# Altium schematic sheet Connectors.SchDoc
size A4
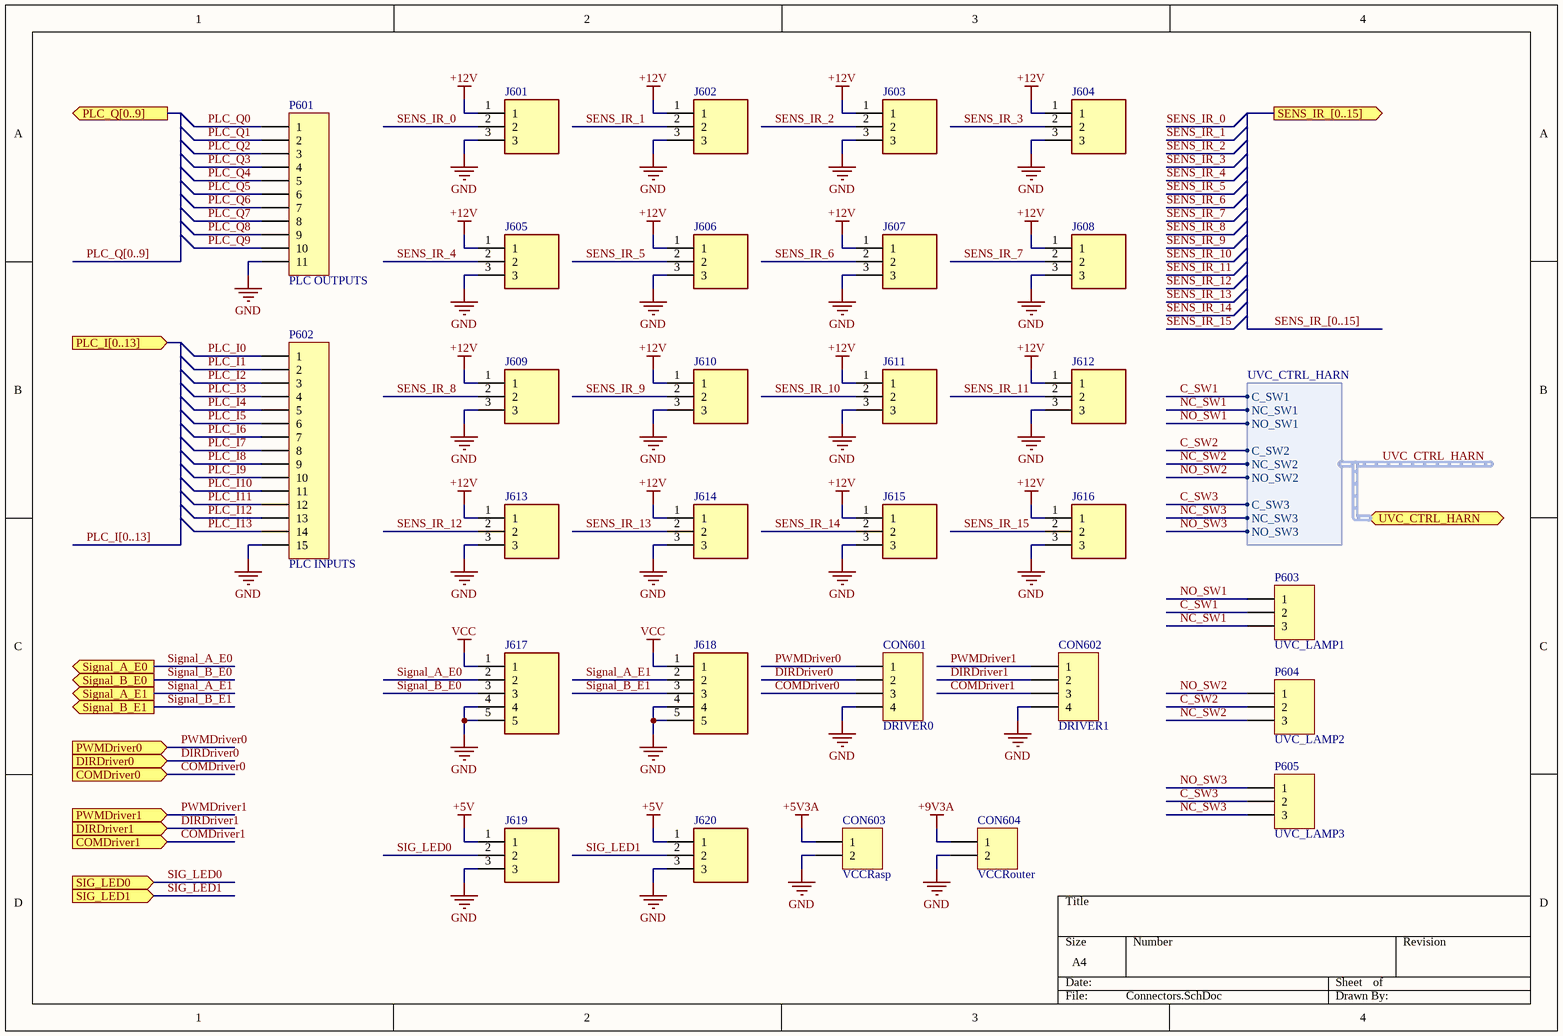
[diagram p0: Connectors.SchDoc]

## Parts
CON601  VALOR: DRIVER0  [PW4 - Recto]  (hidden comment: Header PW4 - Recto)
CON602  VALOR: DRIVER1  [PW4 - Recto]  (hidden comment: Header PW4 - Recto)
CON603  VALOR: VCCRasp  [PW2 - Recto]  (hidden comment: Header PW2 - Recto)
CON604  VALOR: VCCRouter  [PW2 - Recto]  (hidden comment: Header PW2 - Recto)
J601  TBL002A-350-03GR-2OR  [CUI_TBL002A-350-03GR-2OR]  (value not drawn)
J602  TBL002A-350-03GR-2OR  [CUI_TBL002A-350-03GR-2OR]  (value not drawn)
J603  TBL002A-350-03GR-2OR  [CUI_TBL002A-350-03GR-2OR]  (value not drawn)
J604  TBL002A-350-03GR-2OR  [CUI_TBL002A-350-03GR-2OR]  (value not drawn)
J605  TBL002A-350-03GR-2OR  [CUI_TBL002A-350-03GR-2OR]  (value not drawn)
J606  TBL002A-350-03GR-2OR  [CUI_TBL002A-350-03GR-2OR]  (value not drawn)
J607  TBL002A-350-03GR-2OR  [CUI_TBL002A-350-03GR-2OR]  (value not drawn)
J608  TBL002A-350-03GR-2OR  [CUI_TBL002A-350-03GR-2OR]  (value not drawn)
J609  TBL002A-350-03GR-2OR  [CUI_TBL002A-350-03GR-2OR]  (value not drawn)
J610  TBL002A-350-03GR-2OR  [CUI_TBL002A-350-03GR-2OR]  (value not drawn)
J611  TBL002A-350-03GR-2OR  [CUI_TBL002A-350-03GR-2OR]  (value not drawn)
J612  TBL002A-350-03GR-2OR  [CUI_TBL002A-350-03GR-2OR]  (value not drawn)
J613  TBL002A-350-03GR-2OR  [CUI_TBL002A-350-03GR-2OR]  (value not drawn)
J614  TBL002A-350-03GR-2OR  [CUI_TBL002A-350-03GR-2OR]  (value not drawn)
J615  TBL002A-350-03GR-2OR  [CUI_TBL002A-350-03GR-2OR]  (value not drawn)
J616  TBL002A-350-03GR-2OR  [CUI_TBL002A-350-03GR-2OR]  (value not drawn)
J617  TBL002A-350-05GR-2OR  [CUI_TBL002A-350-05GR-2OR]  (value not drawn)
J618  TBL002A-350-05GR-2OR  [CUI_TBL002A-350-05GR-2OR]  (value not drawn)
J619  TBL002A-350-03GR-2OR  [CUI_TBL002A-350-03GR-2OR]  (value not drawn)
J620  TBL002A-350-03GR-2OR  [CUI_TBL002A-350-03GR-2OR]  (value not drawn)
P601  PLC OUTPUTS  [SPTAF_1/15-3.5-EL_11POS]
P602  PLC INPUTS  [SPTAF_1/15-3.5-EL_15POS]
P603  UVC_LAMP1  [Terminal_3way_508]
P604  UVC_LAMP2  [Terminal_3way_508]
P605  UVC_LAMP3  [Terminal_3way_508]

## Ports
COMDriver0 (in), COMDriver1 (in), DIRDriver0 (in), DIRDriver1 (in), PLC_I[0..13] (in), PLC_Q[0..9] (out), PWMDriver0 (in), PWMDriver1 (in), SENS_IR_[0..15] (out), SIG_LED0 (in), SIG_LED1 (in), Signal_A_E0 (out), Signal_A_E1 (out), Signal_B_E0 (out), Signal_B_E1 (out), UVC_CTRL_HARN (harness UVC_CTRL_HARN)

## Harnesses
UVC_CTRL_HARN: C_SW1, NC_SW1, NO_SW1, C_SW2, NC_SW2, NO_SW2, C_SW3, NC_SW3, NO_SW3

## Nets
+5V: J619.1 J620.1
+5V3A: CON603.1
+9V3A: CON604.1
+12V: J601.1 J602.1 J603.1 J604.1 J605.1 J606.1 J607.1 J608.1 J609.1 J610.1 J611.1 J612.1 J613.1 J614.1 J615.1 J616.1
GND: CON601.4 CON602.4 CON603.2 CON604.2 J601.3 J602.3 J603.3 J604.3 J605.3 J606.3 J607.3 J608.3 J609.3 J610.3 J611.3 J612.3 J613.3 J614.3 J615.3 J616.3 J617.4 J617.5 J618.4 J618.5 J619.3 J620.3 P601.11 P602.15
VCC: J617.1 J618.1
C_SW1: P603.2 ; port UVC_CTRL_HARN.C_SW1
C_SW2: P604.2 ; port UVC_CTRL_HARN.C_SW2
C_SW3: P605.2 ; port UVC_CTRL_HARN.C_SW3
COMDriver0: CON601.3 ; port COMDriver0
COMDriver1: CON602.3 ; port COMDriver1
DIRDriver0: CON601.2 ; port DIRDriver0
DIRDriver1: CON602.2 ; port DIRDriver1
NC_SW1: P603.3 ; port UVC_CTRL_HARN.NC_SW1
NC_SW2: P604.3 ; port UVC_CTRL_HARN.NC_SW2
NC_SW3: P605.3 ; port UVC_CTRL_HARN.NC_SW3
NO_SW1: P603.1 ; port UVC_CTRL_HARN.NO_SW1
NO_SW2: P604.1 ; port UVC_CTRL_HARN.NO_SW2
NO_SW3: P605.1 ; port UVC_CTRL_HARN.NO_SW3
PLC_I0: P602.1
PLC_I1: P602.2
PLC_I2: P602.3
PLC_I3: P602.4
PLC_I4: P602.5
PLC_I5: P602.6
PLC_I6: P602.7
PLC_I7: P602.8
PLC_I8: P602.9
PLC_I9: P602.10
PLC_I10: P602.11
PLC_I11: P602.12
PLC_I12: P602.13
PLC_I13: P602.14
PLC_Q0: P601.1
PLC_Q1: P601.2
PLC_Q2: P601.3
PLC_Q3: P601.4
PLC_Q4: P601.5
PLC_Q5: P601.6
PLC_Q6: P601.7
PLC_Q7: P601.8
PLC_Q8: P601.9
PLC_Q9: P601.10
PWMDriver0: CON601.1 ; port PWMDriver0
PWMDriver1: CON602.1 ; port PWMDriver1
SENS_IR_0: J601.2
SENS_IR_1: J602.2
SENS_IR_2: J603.2
SENS_IR_3: J604.2
SENS_IR_4: J605.2
SENS_IR_5: J606.2
SENS_IR_6: J607.2
SENS_IR_7: J608.2
SENS_IR_8: J609.2
SENS_IR_9: J610.2
SENS_IR_10: J611.2
SENS_IR_11: J612.2
SENS_IR_12: J613.2
SENS_IR_13: J614.2
SENS_IR_14: J615.2
SENS_IR_15: J616.2
SIG_LED0: J619.2 ; port SIG_LED0
SIG_LED1: J620.2 ; port SIG_LED1
Signal_A_E0: J617.2 ; port Signal_A_E0
Signal_A_E1: J618.2 ; port Signal_A_E1
Signal_B_E0: J617.3 ; port Signal_B_E0
Signal_B_E1: J618.3 ; port Signal_B_E1

## Buses and harness runs
bus PLC_I[0..13] = port PLC_I[0..13]
bus PLC_Q[0..9] = port PLC_Q[0..9]
bus SENS_IR_[0..15] = port SENS_IR_[0..15]
harness UVC_CTRL_HARN = port UVC_CTRL_HARN

## Library data of the parts
CON601 CON602 = Header PW4 - Recto: Header PW - paso 0.156"; PROVEEDOR: *; FABRICANTE: *; CODIGO RUF: *; PART NUMBER: *; Arrow: B4P-VH(LF)(SN); Digikey: 455-1641-ND; Digikey Housing: 455-1185-ND; Digikey Pin: 455-1319-1-ND
CON603 CON604 = Header PW2 - Recto: Header PW - paso 0.156"; PROVEEDOR: *; FABRICANTE: *; CODIGO RUF: *; PART NUMBER: *; Arrow: B2P-VH (LF) (SN); Digikey: 455-1639-ND; Digikey Housing: 455-1183-ND; Digikey Pin: 455-1319-1-ND
J601-J616 J619 J620 = TBL002A-350-03GR-2OR: 1~24 Poles, Screwless, 45°, 3.50 Pitch, 24~20 (AWG), Terminal Block Connector; MF: CUI Devices; MP: TBL002A-350-03GR-2OR; Value: *; Availability: Good; Package: None; Price: None; SnapEDA_Link: https://www.snapeda.com/parts/TBL002A-350-03GR-2OR/CUI%20Devices/view-part/3233282/?ref=snap; Purchase-URL: https://pricing.snapeda.com/search/part/TBL002A-350-03GR-2OR/?ref=eda; CUI_purchase_URL: https://www.cuidevices.com/product/interconnect/connectors/terminal-blocks/tbl002a-350-series?utm_source=snapeda.com&utm_medium=referral&utm_campaign=snapedaBOM; Check_prices: https://www.snapeda.com/parts/TBL002A-350-03GR-2OR/CUI%20Devices/view-part/3233282/?ref=eda; Arrow: TBL002A-350-03GR-2OR; Digikey: 102-6380-ND
J617 J618 = TBL002A-350-05GR-2OR: 1~24 Poles, Screwless, 45°, 3.50 Pitch, 24~20 (AWG), Terminal Block Connector; MF: CUI Devices; Price: None; Check_prices: https://www.snapeda.com/parts/TBL002A-350-05GR-2OR/CUI%20Devices/view-part/3232875/?ref=eda; Package: None; Purchase-URL: https://pricing.snapeda.com/search/part/TBL002A-350-05GR-2OR/?ref=eda; SnapEDA_Link: https://www.snapeda.com/parts/TBL002A-350-05GR-2OR/CUI%20Devices/view-part/3232875/?ref=snap; CUI_purchase_URL: https://www.cuidevices.com/product/interconnect/connectors/terminal-blocks/tbl002a-350-series?utm_source=snapeda.com&utm_medium=referral&utm_campaign=snapedaBOM; Value: *; MP: TBL002A-350-05GR-2OR; Availability: Warning; Arrow: TBL002A-350-05GR-2OR; Digikey: 102-6382-ND
P601 = Header 11: Header, 11-Pin; LatestRevisionDate: 17-Jul-2002; LatestRevisionNote: Re-released for DXP Platform.; Publisher: Altium Limited; Arrow: 1862136; Digikey: 277-12163-ND
P602 = Header 15: Header, 15-Pin; LatestRevisionDate: 17-Jul-2002; LatestRevisionNote: Re-released for DXP Platform.; Publisher: Altium Limited; Arrow: 1862259; Digikey: 277-12167-ND
P603-P605 = Header 3: Header, 3-Pin; LatestRevisionDate: 17-Jul-2002; LatestRevisionNote: Re-released for DXP Platform.; Publisher: Altium Limited; Arrow: TB006-508-03BE; Digikey: 102-6192-ND